# Altium schematic sheet Inverter.SchDoc
size Letter; SheetNumber: 2; SheetTotal: 4
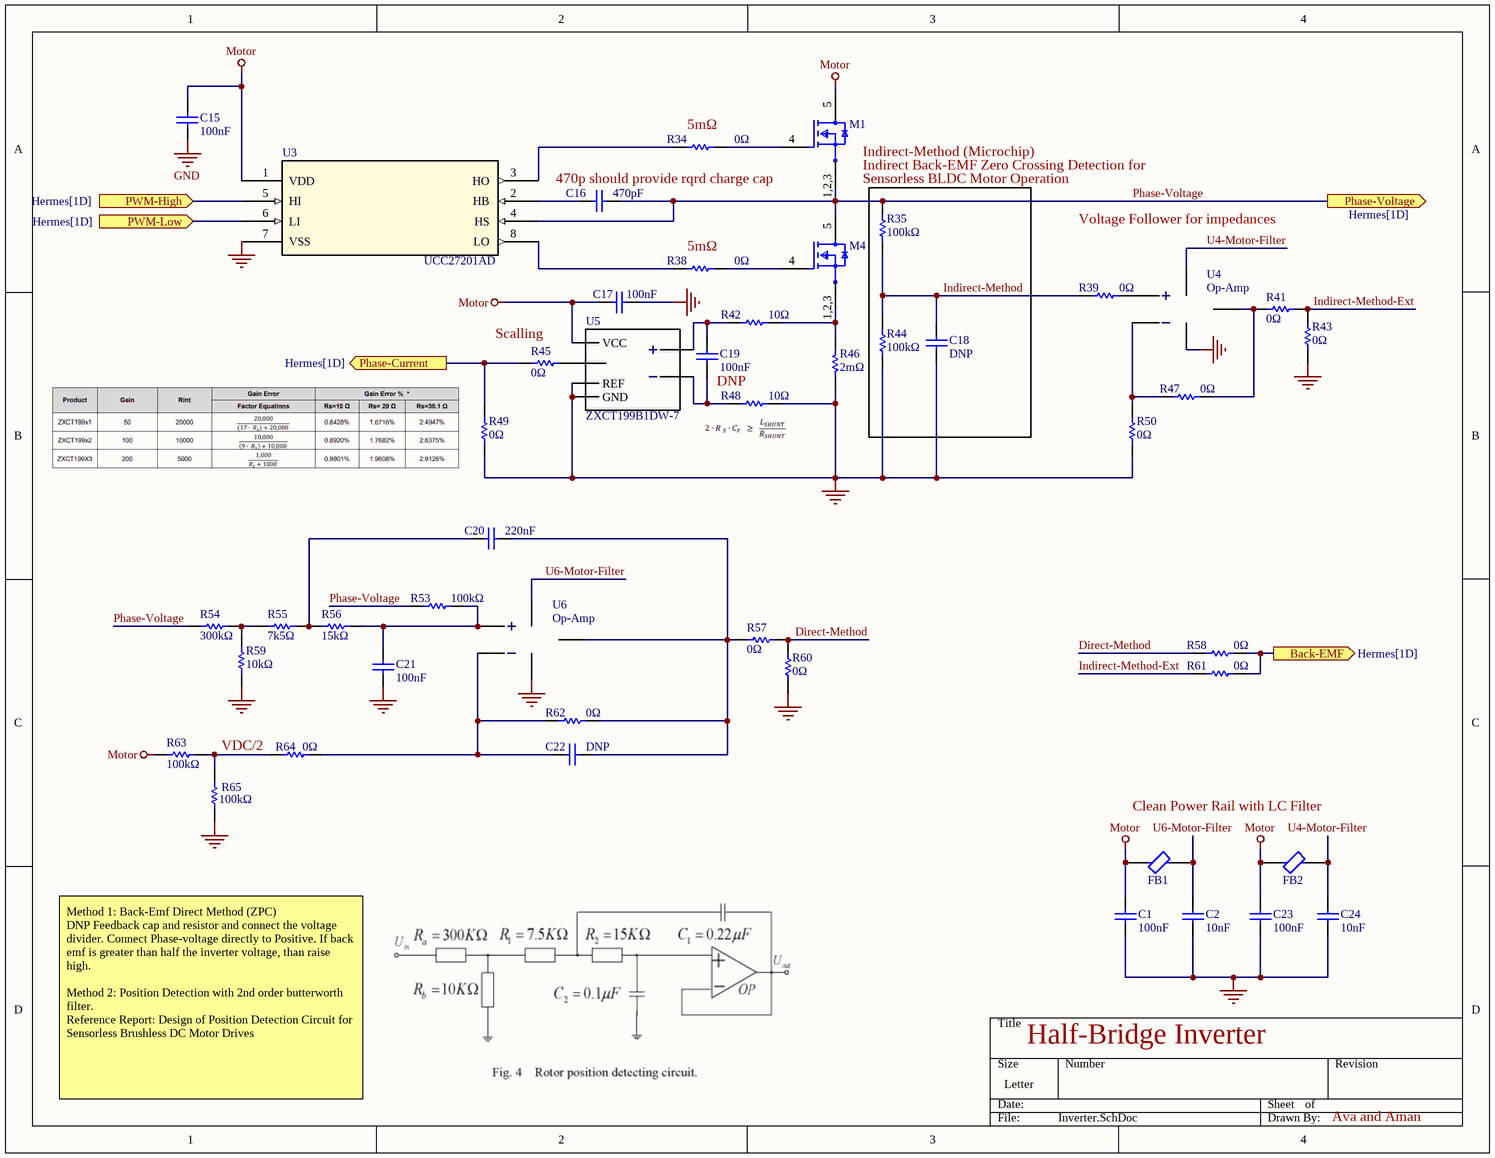
[diagram p0: Inverter.SchDoc]

## Parts
C1  100nF  [CAP, 0603]
C2  10nF  [CAP, 0603]
C15  100nF  [CAP, 0603]
C16  470pF  [Cap, 1206]
C17  100nF  [CAP, 0603]
C18  DNP  [CAP, 0603]
C19  100nF  [CAP, 0603]
C20  220nF  [CAP, 0603]
C21  100nF  [CAP, 0603]
C22  DNP  [CAP, 0603]
C23  100nF  [CAP, 0603]
C24  10nF  [CAP, 0603]
FB1  Ferrite, 0603  [Ferrite, 0603]  (value not drawn)
FB2  Ferrite, 0603  [Ferrite, 0603]  (value not drawn)
M1  PSMN6R1-25MLDX  [FP-SOT1210-MFG]  (value not drawn)
M4  PSMN6R1-25MLDX  [FP-SOT1210-MFG]  (value not drawn)
R34  0Ω  [Res, 0603]
R35  100kΩ  [Res, 0603]
R38  0Ω  [Res, 0603]
R39  0Ω  [Res, 0603]
R41  0Ω  [Res, 0603]
R42  10Ω  [Res, 0603]
R43  0Ω  [Res, 0603]
R44  100kΩ  [Res, 0603]
R45  0Ω  [Res, 0603]
R46  2mΩ  [Res, 2512]
R47  0Ω  [Res, 0603]
R48  10Ω  [Res, 0603]
R49  0Ω  [Res, 0603]
R50  0Ω  [Res, 0603]
R53  100kΩ  [Res, 0603]
R54  300kΩ  [Res, 0603]
R55  7k5Ω  [Res, 0603]
R56  15kΩ  [Res, 0603]
R57  0Ω  [Res, 0603]
R58  0Ω  [Res, 0603]
R59  10kΩ  [Res, 0603]
R60  0Ω  [Res, 0603]
R61  0Ω  [Res, 0603]
R62  0Ω  [Res, 0603]
R63  100kΩ  [Res, 0603]
R64  0Ω  [Res, 0603]
R65  100kΩ  [Res, 0603]
U3  UCC27201AD  [D8]
U4  Op-Amp  [SOT-753]
U5  ZXCT199B1DW-7  [SOT-363]
U6  Op-Amp  [SOT-753]

## Ports
Back-EMF (out, see Hermes[1D]), Phase-Current (out, see Hermes[1D]), Phase-Voltage (out, see Hermes[1D]), PWM-High (in, see Hermes[1D]), PWM-Low (in, see Hermes[1D])

## Nets
GND: C1.2(Cathode) C2.2(Cathode) C15.1(Anode) C17.2(Cathode) C18.1(Anode) C21.1(Anode) C23.2(Cathode) C24.2(Cathode) R43.1 R44.2 R46.1 R48.2 R49.1 R50.1 R59.1 R60.1 R65.2 U3.7(VSS) U4.2(Vcc-) U5.1(REF) U5.2(GND) U6.2(Vcc-)
Motor: C1.1(Anode) C15.2(Cathode) C17.1(Anode) C23.1(Anode) FB1.1 FB2.1 M1.5(D) R63.1 U3.1(VDD) U5.3(VCC)
Back-EMF: R58.2 R61.2 ; port Back-EMF
Direct-Method: R57.1 R58.1 R60.2
Indirect-Method: C18.2(Cathode) R35.2 R39.1 R44.1
Indirect-Method-Ext: R41.1 R43.2 R61.1
Phase-Current: R45.2 R49.2 ; port Phase-Current
Phase-Voltage: C16.2(Cathode) M1.1,2,3(S) M4.5(D) R35.1 R53.1 R54.1 U3.4(HS) ; port Phase-Voltage
PWM-High: U3.5(HI) ; port PWM-High
PWM-Low: U3.6(LI) ; port PWM-Low
U4-Motor-Filter: C24.1(Anode) FB2.2 U4.5(Vcc_+)
U6-Motor-Filter: C2.1(Anode) FB1.2 U6.5(Vcc_+)
NetC16_1: C16.1(Anode) U3.2(HB)
NetC19_1: C19.1(Anode) R48.1 U5.5(V-)
NetC19_2: C19.2(Cathode) R42.1 U5.4(V+)
NetC20_1: C20.1(Anode) R55.2 R56.1
NetC20_2: C20.2(Cathode) C22.2(Cathode) R57.2 R62.2 U6.1(Out)
NetC21_2: C21.2(Cathode) R53.2 R56.2 U6.3(V+)
NetC22_1: C22.1(Anode) R62.1 R64.2 U6.4(V-)
NetM1_4: M1.4(G) R34.2
NetM4_1,2,3: M4.1,2,3(S) R42.2 R46.2
NetM4_4: M4.4(G) R38.2
NetR34_1: R34.1 U3.3(HO)
NetR38_1: R38.1 U3.8(LO)
NetR39_2: R39.2 U4.3(V+)
NetR41_2: R41.2 R47.2 U4.1(Out)
NetR45_1: R45.1 U5.6(Out)
NetR47_1: R47.1 R50.2 U4.4(V-)
NetR54_2: R54.2 R55.1 R59.2
NetR63_2: R63.2 R64.1 R65.1

## Notes on the sheet
- (near R34) 5mΩ
- (near M1) Indirect-Method (Microchip)
- 470p should provide rqrd charge cap
- Indirect Back-EMF Zero Crossing Detection for
- Sensorless BLDC Motor Operation
- Voltage Follower for impedances
- (near R38) 5mΩ
- (near R45) Scalling
- DNP
- VDC/2
- Clean Power Rail with LC Filter
- Half-Bridge Inverter
- Method 1: Back-Emf Direct Method (ZPC)
  DNP Feedback cap and resistor and connect the voltage divider. Connect Phase-voltage directly to Positive. If back emf is greater than half the inverter voltage, than raise high.
  Method 2: Position Detection with 2nd order butterworth filter.
  Reference Report: Design of Position Detection Circuit for Sensorless Brushless DC Motor Drives
- Ava and Aman

## Library data of the parts
C1 C2 C15 C17-C24 = Cap, 0603
C16 = Cap, 1206
M1 M4 = InverterNmos: PSMN6R1-25MLD/MLFPAK/REEL 7 Q
R34 R35 R38 R39 R41-R45 R47-R50 R53-R65 = Res, 0603
R46 = Res, 2512
U3 = UCC27201AD: Half bridge Mosfet driver; Mfr_Name: Texas Instruments; RefDes: RefDes; Type: Type; Supplier 1: Digi-Key
U4 U6 = TLV271CW5-7: For back-emf measurement; Supplier 1: Digi-Key; Supplier Part Number 1: TLV271CW5-7DICT-ND
U5 = ZXCT199B1DW-7: for half-bridge Current monitor; Supplier 1: DigiKey; Supplier Part Number 1: 31-ZXCT199B1DW-7CT-ND
FB1 FB2 = Ferrite, 0603: Supplier 1: Digi-Key; Supplier Part Number 1: 732-6703-1-ND